# Altium schematic sheet PDM-S01-V00-PDMCConnectorInterface.SchDoc: PDMC Connector Interface
size A3; DrawnBy: Zoe Goodward; Organization: QUT Motorsport; Address1: O-120, Gardens Point; Address2: 2 George Street; Address3: Brisbane, QLD 4000; Address4: Australia; DocumentNumber: ####; Revision: 01; SheetNumber: 1; SheetTotal: 1; Version: 01; Project: Power Distribution Module 2020; PageSetup: Record=PageOptions|CenterHorizontal=True|CenterVertical=True|PrintScale=0.97|XCorrection=1.00|YCorrection=1.00|PrintKind=0|BorderSize=5000000|LeftOffset=0|BottomOffset=0|Orientation=2|PaperLength=1000|PaperWidth=1000|Scale=100|PaperSource=7|PrintQuality=-4|MediaType=1|DitherType=10|PaperKind=A4|PrintScaleMode=1
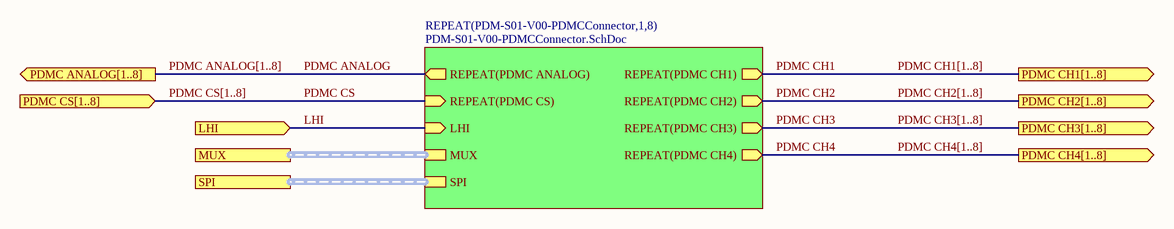
[diagram p0: PDM-S01-V00-PDMCConnectorInterface.SchDoc]

## Sub-sheets
REPEAT(PDM-S01-V00-PDMCConnector,1,8) = PDM-S01-V00-PDMCConnector.SchDoc: REPEAT(PDMC ANALOG) (out), REPEAT(PDMC CS) (in), LHI (in), MUX (harness MUX), SPI (harness SPI), REPEAT(PDMC CH2) (out), REPEAT(PDMC CH1) (out), REPEAT(PDMC CH4) (out), REPEAT(PDMC CH3) (out)

## Ports
LHI (in), MUX, PDMC ANALOG[1..8] (out), PDMC CH1[1..8] (out), PDMC CH2[1..8] (out), PDMC CH3[1..8] (out), PDMC CH4[1..8] (out), PDMC CS[1..8] (in), SPI

## Nets
LHI: port LHI, sheet REPEAT(PDM-S01-V00-PDMCConnector,1,8)/LHI
PDMC ANALOG: sheet REPEAT(PDM-S01-V00-PDMCConnector,1,8)/REPEAT(PDMC ANALOG)
PDMC CH1: sheet REPEAT(PDM-S01-V00-PDMCConnector,1,8)/REPEAT(PDMC CH1)
PDMC CH2: sheet REPEAT(PDM-S01-V00-PDMCConnector,1,8)/REPEAT(PDMC CH2)
PDMC CH3: sheet REPEAT(PDM-S01-V00-PDMCConnector,1,8)/REPEAT(PDMC CH3)
PDMC CH4: sheet REPEAT(PDM-S01-V00-PDMCConnector,1,8)/REPEAT(PDMC CH4)
PDMC CS: sheet REPEAT(PDM-S01-V00-PDMCConnector,1,8)/REPEAT(PDMC CS)

## Buses and harness runs
bus PDMC ANALOG[1..8] = port PDMC ANALOG[1..8]
bus PDMC CH1[1..8] = port PDMC CH1[1..8]
bus PDMC CH2[1..8] = port PDMC CH2[1..8]
bus PDMC CH3[1..8] = port PDMC CH3[1..8]
bus PDMC CH4[1..8] = port PDMC CH4[1..8]
bus PDMC CS[1..8] = port PDMC CS[1..8]
harness port MUX = sheet REPEAT(PDM-S01-V00-PDMCConnector,1,8)/MUX
harness port SPI = sheet REPEAT(PDM-S01-V00-PDMCConnector,1,8)/SPI

## Notes on the sheet
- Revision History:
- Sheet Title:
- Rev
- Date
- Description
- Project:
- Size:
- Drawn By:
- A3
- Number:
- Revision:
- Sheet
- Version:
- of
- QUT Motorsport
- O-120, Gardens Point
- 2 George Street
- Brisbane, QLD 4000
- Australia
- Print Date:
- Print Time:
- File Name: